# Altium schematic sheet STM32_Maestro.SchDoc
size A4; SheetNumber: 21; SheetTotal: 24
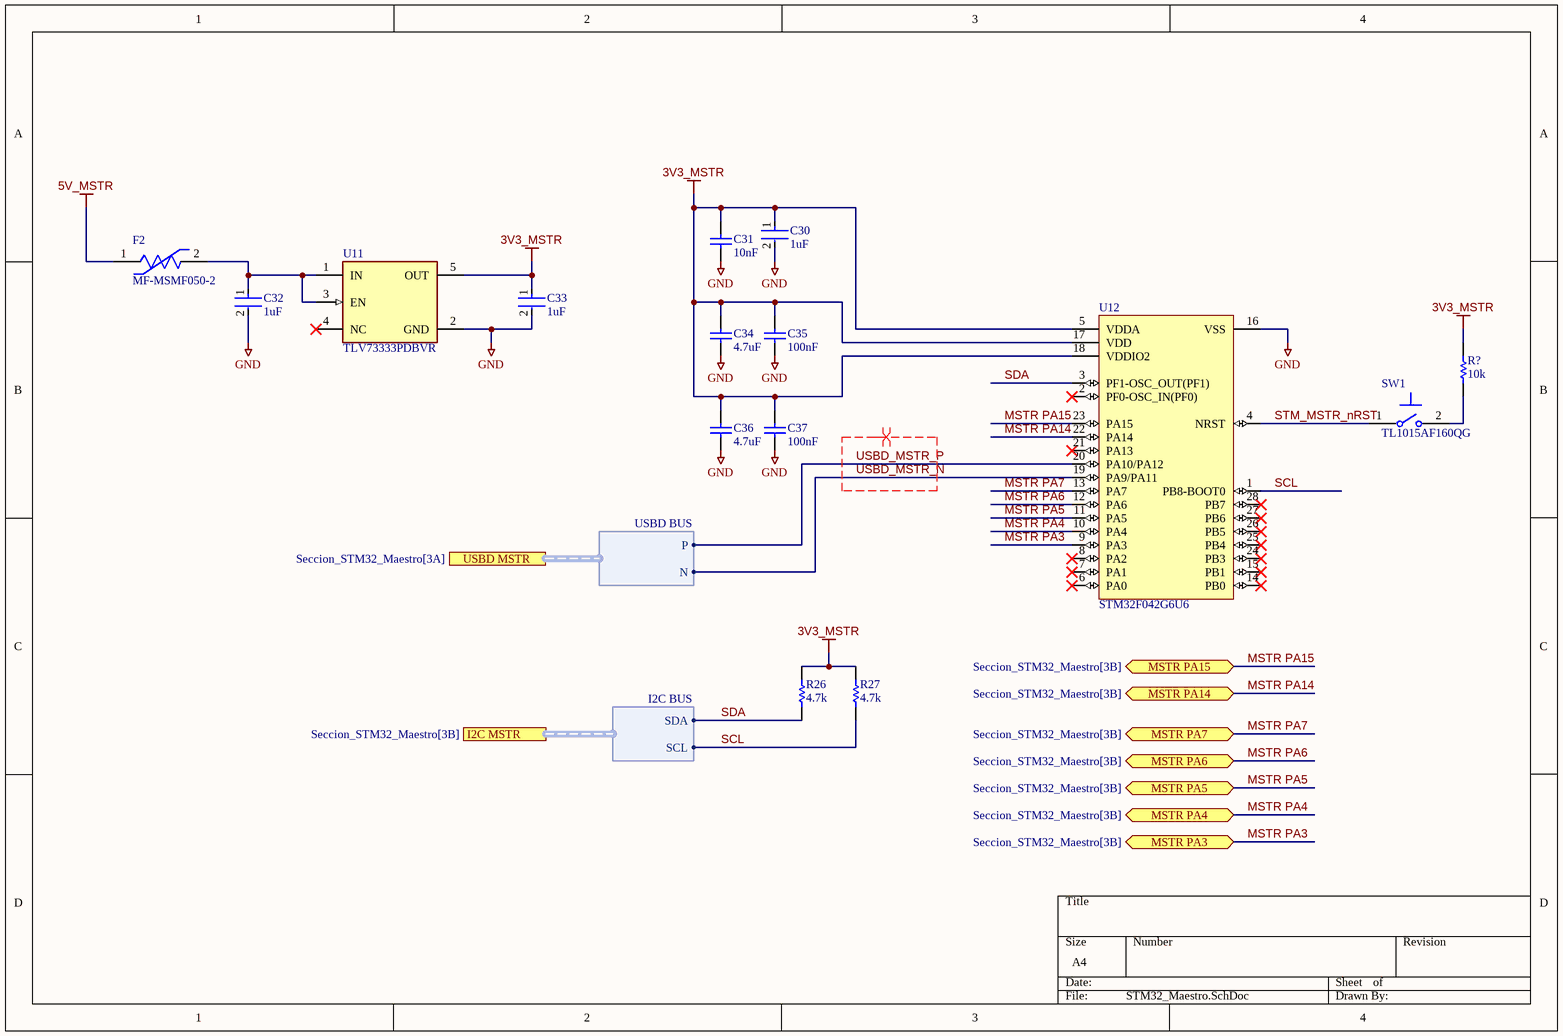
[diagram p0: STM32_Maestro.SchDoc]

## Parts
C30  1uF  [FP-C0402C-BB-IPC_B]
C31  10nF  [CAPC1005X55X25ML05T05]
C32  1uF  [FP-C0402C-BB-IPC_B]
C33  1uF  [FP-C0402C-BB-IPC_B]
C34  4.7uF  [CAPC1005X71X25NL10T15]
C35  100nF  [CAPC1005X55X25NL05T05]
C36  4.7uF  [CAPC1005X71X25NL10T15]
C37  100nF  [CAPC1005X55X25NL05T05]
F2  MF-MSMF050-2  [FP-MF-MSMF050-2-MFG]
R26  4.7k  [RESC1005X40X25ML05T10]
R27  4.7k  [RESC1005X40X25ML05T10]
R?  10k  [RESC1005X40X25ML05T05]
SW1  TL1015AF160QG  [FP-TL1015AF160QG-MFG]
U11  TLV73333PDBVR  [FP-DBV0005A-MFG]
U12  STM32F042G6U6  [STM-UFQFPN28_V]

## Ports
I2C MSTR (harness I2C BUS, see Seccion_STM32_Maestro[3B]), MSTR PA3 (bidir, see Seccion_STM32_Maestro[3B]), MSTR PA4 (bidir, see Seccion_STM32_Maestro[3B]), MSTR PA5 (bidir, see Seccion_STM32_Maestro[3B]), MSTR PA6 (bidir, see Seccion_STM32_Maestro[3B]), MSTR PA7 (bidir, see Seccion_STM32_Maestro[3B]), MSTR PA14 (bidir, see Seccion_STM32_Maestro[3B]), MSTR PA15 (bidir, see Seccion_STM32_Maestro[3B]), USBD MSTR (harness USBD Bus, see Seccion_STM32_Maestro[3A])

## Harnesses
USBD BUS: P, N
I2C BUS: SDA, SCL

## Nets
3V3_MSTR: C30.1 C31.2 C33.1 C34.2 C35.2 C36.2 C37.2 R26.2 R27.2 R?.2 U11.5(OUT) U12.5(VDDA) U12.17(VDD) U12.18(VDDIO2)
5V_MSTR: F2.1
GND: C30.2 C31.1 C32.2 C33.2 C34.1 C35.1 C36.1 C37.1 U11.2(GND) U12.16(VSS)
MSTR PA3: U12.9(PA3) ; port MSTR PA3
MSTR PA4: U12.10(PA4) ; port MSTR PA4
MSTR PA5: U12.11(PA5) ; port MSTR PA5
MSTR PA6: U12.12(PA6) ; port MSTR PA6
MSTR PA7: U12.13(PA7) ; port MSTR PA7
MSTR PA14: U12.22(PA14) ; port MSTR PA14
MSTR PA15: U12.23(PA15) ; port MSTR PA15
SCL: R27.1 U12.1(PB8-BOOT0) ; port I2C MSTR.SCL
SDA: R26.1 U12.3(PF1-OSC_OUT(PF1)) ; port I2C MSTR.SDA
STM_MSTR_nRST: SW1.1 U12.4(NRST)
USBD_MSTR_N: U12.19(PA9/PA11) ; port USBD MSTR.N
USBD_MSTR_P: U12.20(PA10/PA12) ; port USBD MSTR.P
NetC32_1: C32.1 F2.2 U11.1(IN) U11.3(EN)
NetR?_1: R?.1 SW1.2

Not connected (* = marked no-connect by the designer): U11 4(NC)*; U12 2(PF0-OSC_IN(PF0))* 6(PA0)* 7(PA1)* 8(PA2)* 14(PB0)* 15(PB1)* 21(PA13)* 24(PB3)* 25(PB4)* 26(PB5)* 27(PB6)* 28(PB7)*

## Layout directives
differential pair: USBD_MSTR_N, USBD_MSTR_P

## Library data of the parts
C30 C32 C33 = CMP-03020-034679-1: CAP CER 1UF 16V X5R 0402; Dielectric Material: Ceramic; Tolerance: 10%; RoHS Compliant: Yes; Voltage Rating (DC): 16V; Voltage Rating: 16V; Max Operating Temperature: 85°C; Packaging: Cut Tape; Width: 0.02inch; Dielectric: X5R; Lead Free: Lead Free; Min Operating Temperature: -55°C; Mount: Surface Mount; Case/Package: 0402; Thickness: 0.022inch; REACH SVHC: No SVHC; Length: 0.039inch; Case Code (Metric): 1005; Case Code (Imperial): 0402; Capacitance: 1uF
C31 = CMP-2008-02027-1: Part Number: VJ0402Y103KXJCW1BC; Manufacturer: Vitramon
C34 C36 = CMP-2008-02043-1: Part Number: 0402ZD475MAT2A; Manufacturer: AVX Interconnect / Elco
C35 C37 = CMP-2008-02030-1: Manufacturer: Vitramon; Part Number: VJ0402Y104KXJCW1BC
F2 = CMP-2100-03653-2: PTC RESET FUSE 15V 500MA 1812; Manufacturer: Bourns; Value: 0.15-1Ω; Trip Current: 1A; Automotive Grade: Grade 3; Trip Time: 0.15s; Current Rating: 100A; Hold Current: 0.5A; Height: 0.85mm; Package: 1812; Voltage Rating: 15V; Temperature Range High: +85°C; Device Class L2: PTC Resettable Fuses; Lead Free: Yes; ComponentLink2URL: http://www.bourns.com/docs/Product-Datasheets/mfmsmf.pdf; Ambient Temperature Range High: +85°C; Mouser Description: PTC Resettable Fuse 0.5A(hold) 1A(trip) 15V 100A 0.8W 0.15s 0.15Ohm SMD Solder Pad 1812 T/R; Digikey Description: PTC RESET FUSE 15V 500MA 1812; Manufacturer Part Number: MF-MSMF050-2; Resistance: 0.15-1Ω; Category: Fuse; ComponentLink2Description: Datasheet; Automotive: Yes; Temperature Range Low: -40°C; RoHS: TRUE; Device Class L1: Circuit Protection; Temperature: -40°C to +85°C; Octopart: https://octopart.com/mf-msmf050-2-bourns-28047; Ambient Temperature Range Low: -40°C; Device Class L3: unset
R26 R27 = CMP-2002-06456-1: Manufacturer: Panasonic; Part Number: ERJ-S02F4701X
R? = CMP-2002-00601-1: Manufacturer: Panasonic; Part Number: ERJ-2RHD1002X
SW1 = CMP-17879-000003-1: SWITCH TACTILE SPST-NO 0.05A 12V; Actuator Type: Standard; Actuator Length: 0.5mm; Contact Current Rating: 50mA; Mechanical Life: 200000Cycles; Switch Function: Off-Mom; Switch Travel: 0.2mm; Illumination Type: Non-Illuminated; Operating Force: 160gf; Actuator Material: Nylon; Electrical Life: 50000Cycles; Throw Configuration: SPST; Contact Resistance: 100mR; Orientation: Straight; Max Voltage Rating (DC): 12V; Max Operating Temperature: 70°C; Package Quantity: 1; Contact Material: Silver; Packaging: Tape and Reel; Mount: Surface Mount; Color: Beige; Termination: Gull Wing; Case/Package: SMD/SMT; Voltage Rating (DC): 12V; Contact Plating: Silver; REACH SVHC: No SVHC; Min Operating Temperature: -20°C; Current Rating: 50mA; Lead Free: Lead Free
U11 = CMP-04917-000053-1: IC REG LINEAR 3.3V 300MA SOT23-5; Manufacturer: Texas Instruments; Max Junction Temp: +125°C; Accuracy Percentage: 1%; Min Supply Voltage: 1.4V; Number Of Outputs: 1; Dropout Voltage: 125mV; Nominal Supply Current: 34uA; Max Supply Voltage: 5.5V; Output Type: Fixed; Standoff Height: 0mm; Digikey Description: IC REG LINEAR 3.3V 300MA SOT23-5; Manufacturer Part Number: TLV73333PDBVR; Temperature Range High: +125°C; Temperature: -40°C to +125°C; Output Current: 300mA; Mouser Description: LDO Voltage Regulators Capacitr-Free 300-mA 5-SOT-23 -40 to 125; Automotive: No; Height: 1.45mm; Device Class L3: Voltage Regulators - Linear; ComponentLink2Description: Datasheet; Device Class L1: Integrated Circuits (ICs); ComponentLink2URL: http://www.ti.com/lit/ds/symlink/tlv733p.pdf; Octopart: https://octopart.com/tlv73333pdbvr-texas+instruments-51080890; Temperature Range Low: -40°C; RoHS: TRUE; Lead Free: Yes; Output Voltage: 3.3V; Package: DBV0005A; Device Class L2: Power Management ICs; Category: IC
U12 = CMP-0304-00112-2: ARM Cortex-M0 32-bit MCU, 32 KB Flash, 6 KB Internal RAM, 24 I/Os, 28-Pin UFQFPN, -40 to 85 degC, Tray; Manufacturer: STMicroelectronics; FLASH Size (Prog) (kB): 32; I/Os (High Current): 24; Internal RAM Size (kB): 6; Supply Voltage(Vcc) min (V): 2; Operating Frequency(F) (Processor speed) (MHz): 48; Core: ARM Cortex-M0; PartNumber: STM32F042G6U6; Packing: Tray; Package Description: 28-Pin Ultra Thin Fine Pitch Quad Flat No-Lead, 4 x 4 x 0.6 mm Body, 0.5 mm Pitch; ComponentLink2Description: Datasheet; ComponentLink1Description: Manufacturer URL; Package Reference: UFQFPN28; DatasheetVersion: Rev. 5; ComponentLink1URL: http://www.st.com/; ComponentLink2URL: http://www.st.com/st-web-ui/static/active/en/resource/technical/document/datasheet/DM00105814.pdf; Mounting Technology: Surface Mount